# Altium schematic sheet Memory Connector.SchDoc
size B; Author: E. Sims; Organization: Let's Build Rockets Inc.; SheetNumber: 2; SheetTotal: 6
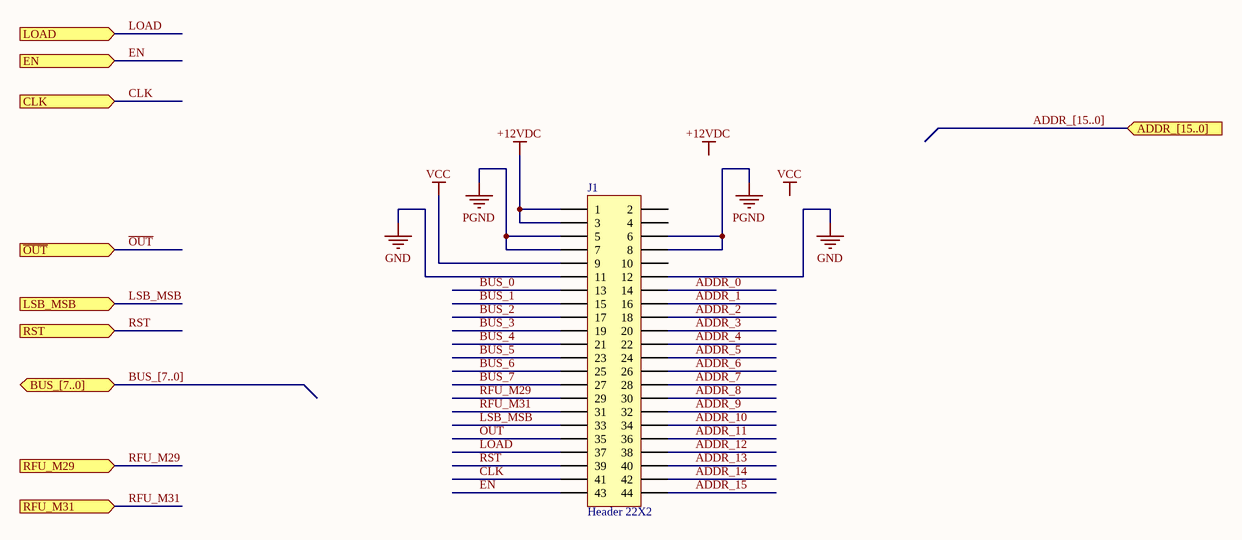
[diagram p0: Memory Connector.SchDoc]

## Parts
J1  Header 22X2  [HDR2X22]

## Ports
ADDR_[15..0] (in), BUS_[7..0] (bidir), CLK (in), EN (in), LOAD (in), LSB_MSB (in), RFU_M29 (in), RFU_M31 (in), RST (in), ~{OUT} (in)

## Nets
+12VDC: J1.1 J1.3
GND: J1.11 J1.12
PGND: J1.5 J1.6 J1.7 J1.8
VCC: J1.9
ADDR_0: J1.14
ADDR_1: J1.16
ADDR_2: J1.18
ADDR_3: J1.20
ADDR_4: J1.22
ADDR_5: J1.24
ADDR_6: J1.26
ADDR_7: J1.28
ADDR_8: J1.30
ADDR_9: J1.32
ADDR_10: J1.34
ADDR_11: J1.36
ADDR_12: J1.38
ADDR_13: J1.40
ADDR_14: J1.42
ADDR_15: J1.44
BUS_0: J1.13
BUS_1: J1.15
BUS_2: J1.17
BUS_3: J1.19
BUS_4: J1.21
BUS_5: J1.23
BUS_6: J1.25
BUS_7: J1.27
CLK: J1.41 ; port CLK
EN: J1.43 ; port EN
LOAD: J1.37 ; port LOAD
LSB_MSB: J1.33 ; port LSB_MSB
~{OUT}: J1.35 ; port ~{OUT}
RFU_M29: J1.29 ; port RFU_M29
RFU_M31: J1.31 ; port RFU_M31
RST: J1.39 ; port RST

Not connected (* = marked no-connect by the designer): J1 2 4 10

## Buses and harness runs
bus ADDR_[15..0] = port ADDR_[15..0]
bus BUS_[7..0] = port BUS_[7..0]

## Notes on the sheet
- Labels drawn without touching a wire or pin: +12VDC, VCC
- Let's Build Rocket's Inc. Modular Paylaod System Based on TMP-010 Rev
  For more information visit https://github.com/LetsBuildRockets/Modular-Payload-System
  This work is licensed under CC BY-NC 4.0. To view a copy of this license, visit https://creativecommons.org/licenses/by-nc/4.0
- Title
- Size:
- Date:
- Assembly Variant:
- B
- Number:
- Time:
- Revision:
- Sheet
- of
- Author:
- File:

## Library data of the parts
J1 = Header 22X2: Header, 22-Pin, Dual row; LatestRevisionDate: 17-Jul-2002; LatestRevisionNote: Re-released for DXP Platform.; Publisher: Altium Limited